# EAGLE design Shield_LevelShifter (EAGLE 9.4.2)
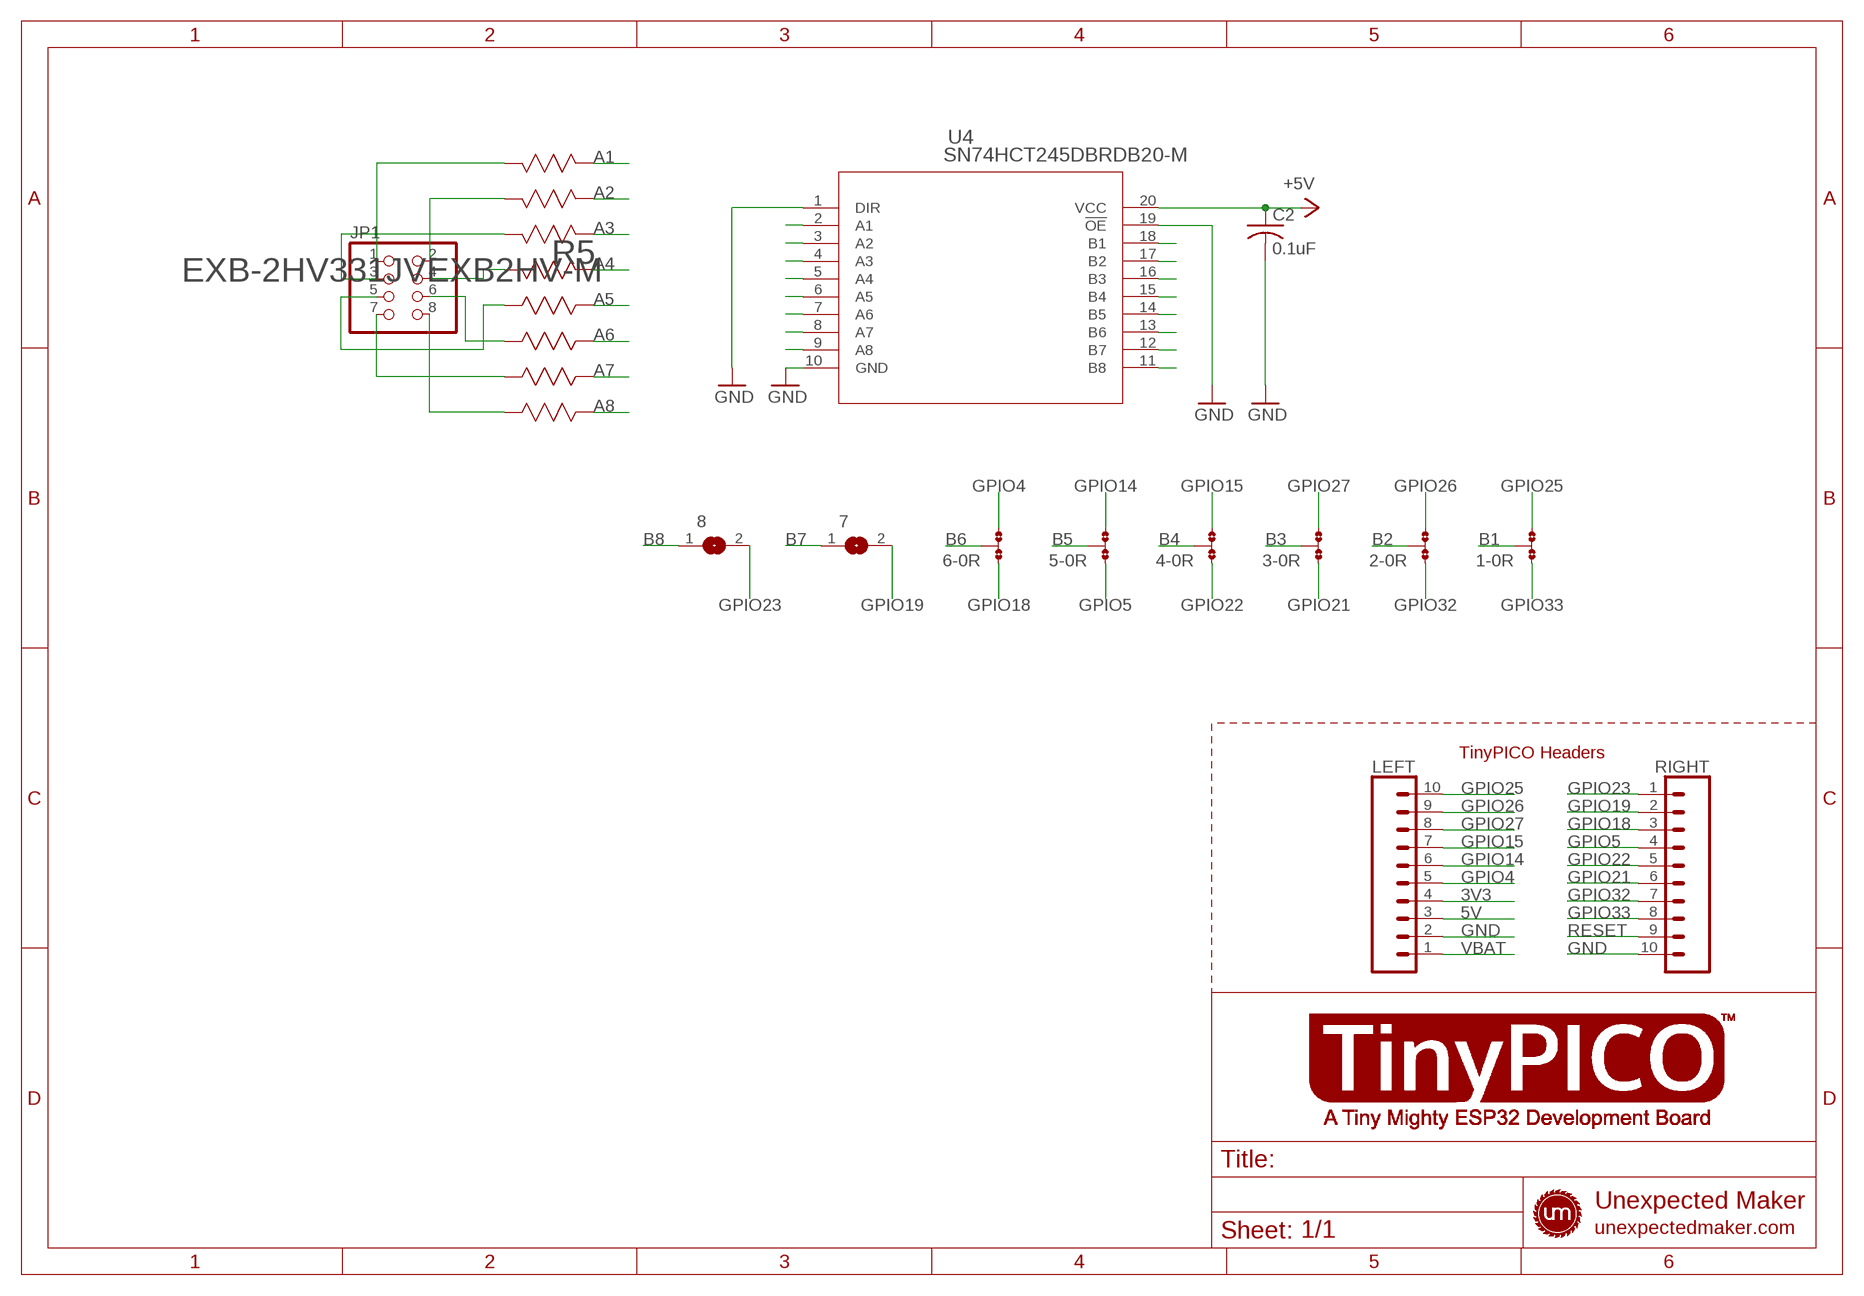
[diagram p0: schematic, sheet 1]

## Parts
1  0R-JUMPD  [C0R-JMP_NONE]
2  0R-JUMPD  [C0R-JMP_NONE]
3  0R-JUMPD  [C0R-JMP_NONE]
4  0R-JUMPD  [C0R-JMP_NONE]
5  0R-JUMPD  [C0R-JMP_NONE]
6  0R-JUMPD  [C0R-JMP_NONE]
7  SJ  [SJ]
8  SJ  [SJ]
C2  0.1uF  C-USC0603  [C0603]
JP1  PINHD-2X4/90  [2X04/90]
LEFT  TINYPICO_HEADER_10NO_SILK_PTH_FEMALE  [1X10_NO_SILK]
R5  EXB-2HV331JVEXB2HV-M  [EXB2HV-M]
RIGHT  TINYPICO_HEADER_10NO_SILK_PTH_FEMALE  [1X10_NO_SILK]
U4  SN74HCT245DBRDB20-M  [DB20-M]

## Nets
3V3: LEFT.4
5V: C2.1 LEFT.3 U4.20(VCC) ; supply symbol labelled +5V
A1: R5.1 U4.2(A1)
A2: R5.2 U4.3(A2)
A3: R5.3 U4.4(A3)
A4: R5.4 U4.5(A4)
A5: R5.5 U4.6(A5)
A6: R5.6 U4.7(A6)
A7: R5.7 U4.8(A7)
A8: R5.8 U4.9(A8)
B1: 1.2 U4.18(B1)
B2: 2.2 U4.17(B2)
B3: 3.2 U4.16(B3)
B4: 4.2 U4.15(B4)
B5: 5.2 U4.14(B5)
B6: 6.2 U4.13(B6)
B7: 7.1 U4.12(B7)
B8: 8.1 U4.11(B8)
GND: C2.2 LEFT.2 RIGHT.10 U4.1(DIR) U4.10(GND) U4.19(!OE)
GPIO4: 6.3 LEFT.5
GPIO5: 5.1 RIGHT.4
GPIO14: 5.3 LEFT.6
GPIO15: 4.3 LEFT.7
GPIO18: 6.1 RIGHT.3
GPIO19: 7.2 RIGHT.2
GPIO21: 3.1 RIGHT.6
GPIO22: 4.1 RIGHT.5
GPIO23: 8.2 RIGHT.1
GPIO25: 1.3 LEFT.10
GPIO26: 2.3 LEFT.9
GPIO27: 3.3 LEFT.8
GPIO32: 2.1 RIGHT.7
GPIO33: 1.1 RIGHT.8
N$1: JP1.1 R5.16
N$2: JP1.4 R5.13
N$3: JP1.2 R5.15
N$4: JP1.3 R5.14
N$5: JP1.5 R5.12
N$6: JP1.6 R5.11
N$7: JP1.7 R5.10
N$8: JP1.8 R5.9
RESET: RIGHT.9
VBAT: LEFT.1

## Notes on the sheet
- TinyPICO Headers

## Library data of the parts
1-6 = pv_jump-0r-smd:0R-JUMP: SMD 0R 0805 Jumper
7 8 = jumper:SJ: SMD solder JUMPER
C2 = adafruit:C-US: CAPACITOR, American symbol
JP1 = pinhead:PINHD-2X4: PIN HEADER
LEFT RIGHT = UnexpectedMaker:TINYPICO_HEADER_10: Multi connection point. Often used as Generic Header-pin footprint for 0.1 inch spaced/style header connections On any of the 0.1 inch spaced packages, you can populate with these: Break Away Headers - Straight <https://www.sparkfun.com/products/116> (PRT-00116) Break Away Male Headers - Right Angle <https://www.sparkfun.com/products/553> (PRT-00553) Female Headers <https://www.sparkfun.com/products/115> (PRT-00115) Break Away Headers - Machine Pin <https://www.sparkfun.com/products/117> (PRT-00117) Break Away Female Headers - Swiss Machine Pin <https://www.sparkfun.com/products/743> (PRT-00743) Arduino Stackable Header - 10 Pin <https://www.sparkfun.com/products/11376> (PRT-11376) For SCREWTERMINALS and SPRING TERMINALS visit here: Screw Terimnals on SparkFun.com <https://www.sparkfun.com/search/results?term=Screw+Terminals> (5mm/3.5mm/2.54mm spacing) This device is also useful as a general connection point to wire up your design to another part of your project. Our various solder wires solder well into these plated through hole pads. Hook-Up Wire - Assortment (Stranded, 22 AWG) <https://www.sparkfun.com/products/11375> (PRT-11375) Hook-Up Wire - Assortment (Solid Core, 22 AWG) <https://www.sparkfun.com/products/11367> (PRT-11367) View the entire wire category on our website here <https://www.sparkfun.com/categories/141> Special notes: Molex polarized connector foot print use with SKU : PRT-08231 with associated crimp pins and housings. 1MM SMD Version SKU: PRT-10208 NOTES ON THE VARIANTS LOCK and LOCK_LONGPADS... This footprint was designed to help hold the alignment of a through-hole component (i.e. 6-pin header) while soldering it into place. You may notice that each hole has been shifted either up or down by 0.005 of an inch from it's more standard position (which is a perfectly straight line). This slight alteration caused the pins (the squares in the middle) to touch the edges of the holes. Because they are alternating, it causes a "brace" to hold the component in place. 0.005 has proven to be the perfect amount of "off-center" position when using our standard breakaway headers. Although looks a little odd when you look at the bare footprint, once you have a header in there, the alteration is very hard to notice. Also,if you push a header all the way into place, it is covered up entirely on the bottom side.; PROD_ID: CONN-11563
R5 = pv:EXB-2HV331JV; MANUFACTURER_PART_NUMBER: EXB2HV331JV; VENDOR: Panasonic
U4 = SN74HCT245:SN74HCT245DBR; MANUFACTURER_PART_NUMBER: SN74HCT245DBR; VENDOR: Texas Instruments

## Board
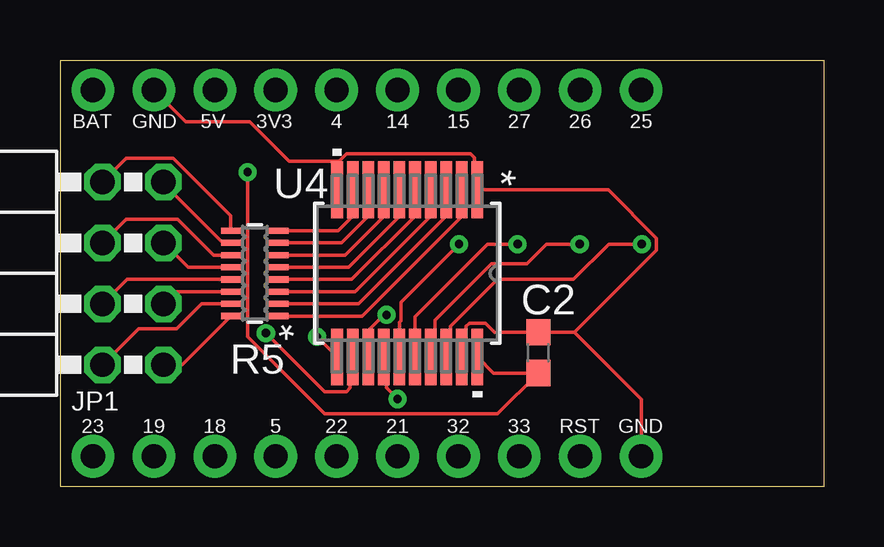
[diagram p1: board, top side]
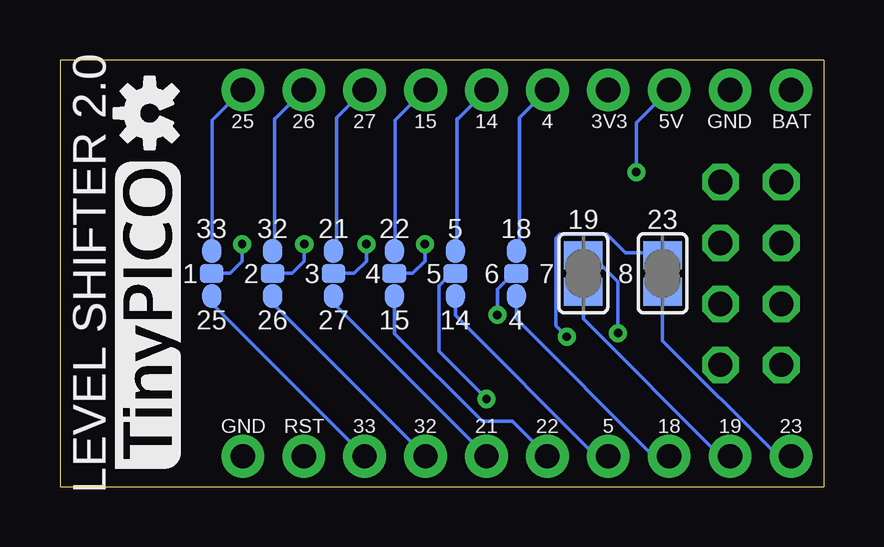
[diagram p2: board, bottom side, seen from below]

Size 31.85 x 17.78 mm. Coordinates in mm from the lower left corner, seen from the top.
Outline: 31.85,0 0,0 0,17.78 31.85,17.78 31.85,0
Copper layers (1*16): Top 0.035mm / dielectric 1.5mm / Bottom 0.035mm
Design rules "default": minimum track width 6mil, minimum drill 0.35mm, track to track 6mil, track to pad 6mil, pad to pad 6mil, via to via 6mil, smd to smd 6mil, copper to edge 40mil, drill to drill 6mil, minimum pad ring 10mil, minimum via ring 8mil, stop-mask expansion 4mil, vias tented up to drill 0mil, thermal gap 10mil

### Footprints (pad centres in the part's own frame; a part is rotated, then mirrored left to right if it is on the bottom)
C0R-JMP_NONE = smd 0.8 x 1: 1 0,0.938; 3 0,-0.938 | smd 1 x 0.8: 2 0,0
SJ = smd 1.168 x 1.6: 1 -0.762,0; 2 0.762,0
C0603 = smd 1.1 x 1: 1 -0.85,0; 2 0.85,0
2X04/90 = drill 1.016 octagon: 1 -3.81,-6.35; 2 -3.81,-3.81; 3 -1.27,-6.35; 4 -1.27,-3.81; 5 1.27,-6.35; 6 1.27,-3.81; 7 3.81,-6.35; 8 3.81,-3.81
1X10_NO_SILK = drill 1.016 pad 1.778: 1 0,0; 2 2.54,0; 3 5.08,0; 4 7.62,0; 5 10.16,0; 6 12.7,0; 7 15.24,0; 8 17.78,0; 9 20.32,0; 10 22.86,0
EXB2HV-M = smd 0.813 x 0.254: 1 -1.003,1.778; 2 -1.003,1.27; 3 -1.003,0.762; 4 -1.003,0.254; 5 -1.003,-0.254; 6 -1.003,-0.762; 7 -1.003,-1.27; 8 -1.003,-1.778; 9 1.003,-1.778; 10 1.003,-1.27; 11 1.003,-0.762; 12 1.003,-0.254; 13 1.003,0.254; 14 1.003,0.762; 15 1.003,1.27; 16 1.003,1.778
DB20-M = smd 2.362 x 0.483: 1 -3.48,2.925; 2 -3.48,2.275; 3 -3.48,1.625; 4 -3.48,0.975; 5 -3.48,0.325; 6 -3.48,-0.325; 7 -3.48,-0.975; 8 -3.48,-1.625; 9 -3.48,-2.275; 10 -3.48,-2.925; 11 3.48,-2.925; 12 3.48,-2.275; 13 3.48,-1.625; 14 3.48,-0.975; 15 3.48,-0.325; 16 3.48,0.325; 17 3.48,0.975; 18 3.48,1.625; 19 3.48,2.275; 20 3.48,2.925

### Placement (x,y rotation side)
1  25.53,8.89 180 bottom
2  22.99,8.89 180 bottom
3  20.45,8.89 180 bottom
4  17.91,8.89 180 bottom
5  15.37,8.89 180 bottom
6  12.83,8.89 180 bottom
7  10.03,8.89 270 bottom
8  6.73,8.89 270 bottom
C2  19.94,5.59 90 top
JP1  -2.03,8.89 90 top
LEFT  1.37,16.54 0 top
LOGO  OSHW-LOGOS  [OSHW-LOGO-S]  28.11,15.56 90 bottom
R5  8.13,8.89 180 top
RIGHT  1.37,1.27 0 top
U4  14.48,8.89 270 top

### Tracks (layer width: path | path; a pad name or v marks a point on that pad's centre or on a via)
5V  (via drill 0.35)
  Top 0.152: v7.82,13.11 7.82,6.25 11.02,3.05 18.25,3.05 C2.1 18.07,4.74 U4.20
  Bottom 0.152: LEFT.3 7.82,15.16 v7.82,13.11
A1
  Top 0.152: R5.1 12.59,7.11 16.75,11.27 U4.2
A2
  Top 0.152: R5.2 12.45,7.62 16.1,11.27 U4.3
A3
  Top 0.152: R5.3 12.31,8.13 15.45,11.27 U4.4
A4
  Top 0.152: R5.4 12.16,8.64 14.8,11.27 U4.5
A5
  Top 0.152: R5.5 12.02,9.14 14.15,11.27 U4.6
A6
  Top 0.152: R5.6 11.88,9.65 13.5,11.27 U4.7
A7
  Top 0.152: R5.7 11.74,10.16 12.85,11.27 U4.8
A8
  Top 0.152: R5.8 11.6,10.67 12.2,11.27 U4.9
B1  (via drill 0.35)
  Top 0.152: U4.18 16.28,5.59 16.28,6.69 18.23,8.64 21.41,8.64 22.88,10.11 v24.26,10.11
  Bottom 0.152: 1.2 24.77,8.89 24.26,9.4 v24.26,10.11
B2  (via drill 0.35)
  Top 0.152: v21.67,10.11 20.28,10.11 19.47,9.3 17.99,9.3 15.63,6.94 15.63,5.59 U4.17
  Bottom 0.152: 2.2 22.17,8.89 21.67,9.4 v21.67,10.11
B3  (via drill 0.35)
  Top 0.152: v19.07,10.11 17.83,10.11 14.8,7.08 U4.16
  Bottom 0.152: 3.2 19.58,8.89 19.07,9.4 v19.07,10.11
B4  (via drill 0.35)
  Top 0.152: v16.64,10.11 14.22,7.69 14.22,6.91 14.15,6.84 U4.15
  Bottom 0.152: 4.2 17.14,8.89 16.64,9.4 v16.64,10.11
B5  (via drill 0.35)
  Top 0.152: v14.07,3.66 13.61,4.12 13.61,5.33 U4.14
  Bottom 0.152: v14.07,3.66 16.05,5.64 16.05,8.38 15.6,8.84 15.44,8.84 5.2
B6  (via drill 0.35)
  Top 0.152: v13.61,7.16 13.51,7.16 12.85,6.51 U4.13
  Bottom 0.152: v13.61,7.16 13.61,8.23 13.01,8.84 12.85,8.84 6.2
B7  (via drill 0.35)
  Top 0.152: v8.59,6.4 11.02,3.96 11.94,3.96 12.09,4.12 12.09,5.33 U4.12
  Bottom 0.152: v8.59,6.4 8.59,8.53 9.65,9.6 9.96,9.6 7.1
B8  (via drill 0.35)
  Top 0.152: v10.72,6.25 11.48,5.49 U4.11
  Bottom 0.152: v10.72,6.25 11.18,6.71 11.18,10.36 11.02,10.52 9.04,10.52 8.28,9.75 6.76,9.75 8.1
GND
  Top 0.152: 11.63,13.56 11.63,12.5 U4.10 | 11.63,13.56 11.94,13.87 17.12,13.87 17.27,13.72 17.27,12.5 U4.1 22.86,12.37 24.86,10.36 24.86,9.86 21.47,6.47 21.44,6.44 | 11.63,13.56 9.55,13.56 7.9,15.21 5.23,15.21 LEFT.2 | 21.44,6.44 24.23,3.65 RIGHT.10 | U4.19 16.93,5.59 16.93,6.69 17.07,6.82 17.74,6.82 18.12,6.44 C2.2 21.44,6.44
GPIO4
  Bottom 0.152: 6.3 12.7,9.91 12.7,15.34 12.7,15.37 LEFT.5
GPIO5
  Bottom 0.152: 5.1 15.37,7.14 9.5,1.27 RIGHT.4
GPIO14
  Bottom 0.152: 5.3 15.29,9.91 15.29,15.34 15.27,15.34 LEFT.6
GPIO15
  Bottom 0.152: 4.3 17.88,9.91 17.88,15.19 17.88,15.27 LEFT.7
GPIO18
  Bottom 0.152: 6.1 12.83,6.99 7.11,1.27 RIGHT.3
GPIO19
  Bottom 0.152: 7.2 10.03,6.99 4.31,1.27 RIGHT.2
GPIO21
  Bottom 0.152: 3.1 20.45,7.64 RIGHT.6
GPIO22
  Bottom 0.152: 4.1 17.91,6.38 14.24,2.72 12.98,2.72 RIGHT.5
GPIO23
  Bottom 0.152: 8.2 6.73,6.09 1.91,1.27 RIGHT.1
GPIO25
  Bottom 0.152: 1.3 25.5,9.91 25.5,15.19 25.5,15.27 LEFT.10
GPIO26
  Bottom 0.152: 2.3 22.91,9.91 22.91,15.34 22.89,15.34 LEFT.9
GPIO27
  Bottom 0.152: 3.3 20.32,9.91 20.32,15.34 20.32,15.37 LEFT.8
GPIO32
  Bottom 0.152: 2.1 22.99,7.64 RIGHT.7
GPIO33
  Bottom 0.152: 1.1 25.53,7.64 RIGHT.8
N$1
  Top 0.152: R5.16 5.09,5.08 JP1.1
N$2
  Top 0.152: R5.13 2.79,8.64 JP1.4
N$3
  Top 0.152: R5.15 5.9,7.62 4.86,6.57 3.27,6.57 JP1.2
N$4
  Top 0.152: R5.14 4.83,8.13 JP1.3
N$5
  Top 0.152: R5.12 5.33,9.14 JP1.5
N$6
  Top 0.152: R5.11 6.41,9.65 4.91,11.15 2.77,11.15 JP1.6
N$7
  Top 0.152: R5.10 6.78,10.16 4.32,12.62 JP1.7
N$8
  Top 0.152: R5.9 7.12,11.29 4.73,13.69 2.77,13.69 JP1.8

### Text on the board
bPlace: 23 | 19 | 18 | 5 | 22 | 21 | 32 | 33 | LEVEL SHIFTER 2.0 | 4 | 14 | 15 | 27 | 26 | 25
tNames: BAT | GND | 5V | 3V3 | 4 | 14 | 15 | 27 | 26 | 25 | 23 | 19 | 18 | 5 | 22 | 21 | 32 | 33 | RST | GND
bNames: BAT | GND | 5V | 3V3 | 4 | 14 | 15 | 27 | 26 | 25 | 23 | 19 | 18 | 5 | 22 | 21 | 32 | 33 | RST | GND